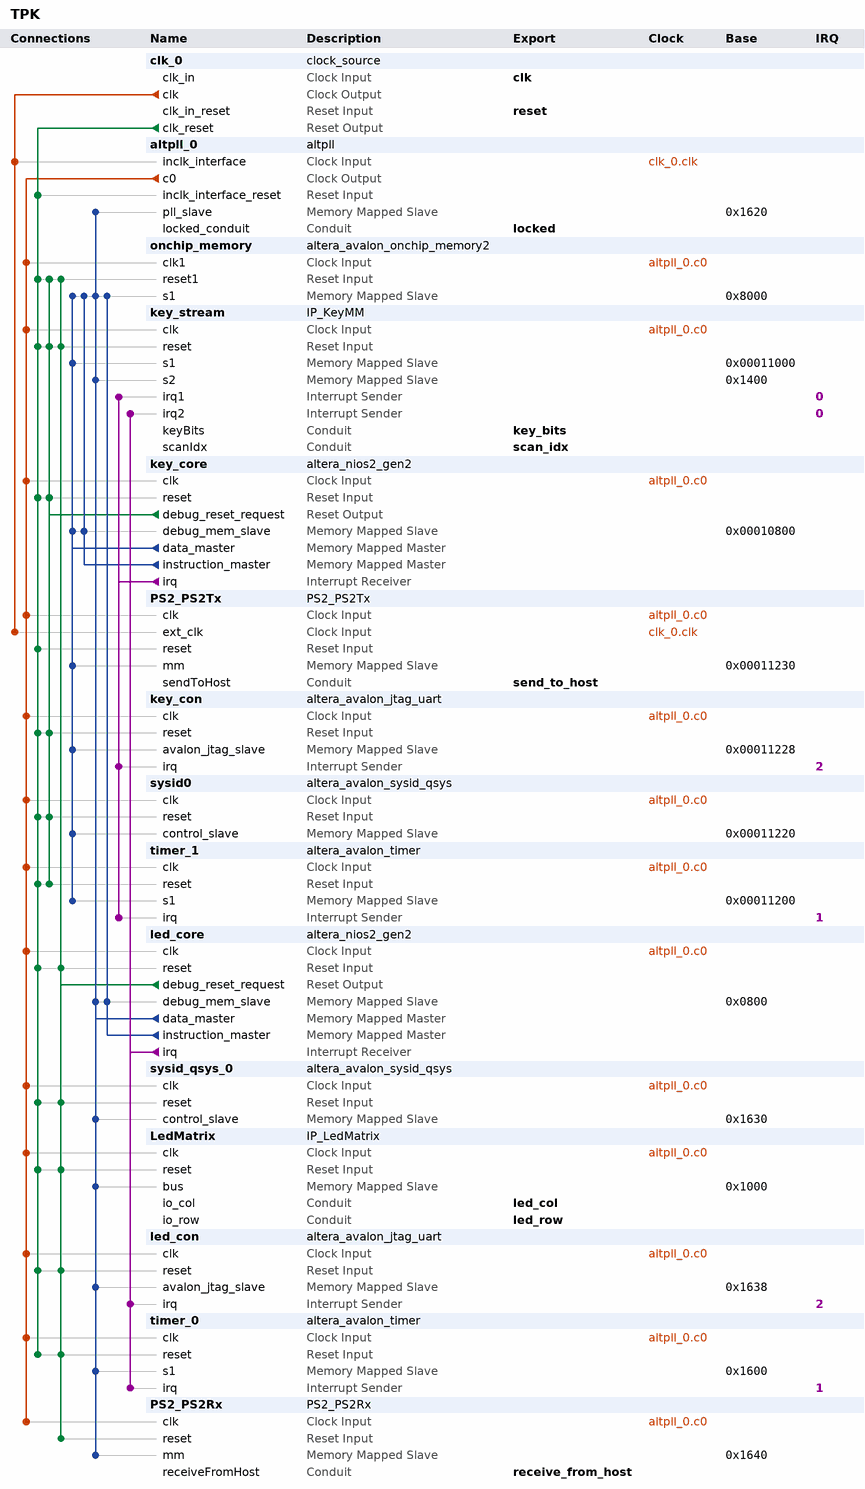
[diagram p0: system contents]
# Platform Designer (Qsys) system TPK, Cyclone IV E EP4CE10E22C8
# Parameters at their usual value, and those the tool derives, are not listed.
package require -exact qsys 21.1
create_system TPK
set_project_property DEVICE_FAMILY {Cyclone IV E}
set_project_property DEVICE EP4CE10E22C8

add_instance clk_0 clock_source 21.1
set_instance_parameter_value clk_0 clockFrequency 50000000

add_instance altpll_0 altpll 21.1
set_instance_parameter_value altpll_0 CLK0_DIVIDE_BY 2
set_instance_parameter_value altpll_0 CLK0_MULTIPLY_BY 3
set_instance_parameter_value altpll_0 INCLK0_INPUT_FREQUENCY 20000
set_instance_parameter_value altpll_0 PORT_ARESET PORT_UNUSED
set_instance_parameter_value altpll_0 PORT_LOCKED PORT_USED
set_instance_parameter_value altpll_0 PORT_clk1 PORT_UNUSED
set_instance_parameter_value altpll_0 PORT_clk2 PORT_UNUSED
set_instance_parameter_value altpll_0 PORT_clk3 PORT_UNUSED

add_instance onchip_memory altera_avalon_onchip_memory2 21.1
set_instance_parameter_value onchip_memory allowInSystemMemoryContentEditor true
set_instance_parameter_value onchip_memory dataWidth 32
set_instance_parameter_value onchip_memory dualPort false
set_instance_parameter_value onchip_memory initMemContent true
set_instance_parameter_value onchip_memory initializationFileName E:/DEVELOPMENT/PROJECTS/TPK/Qsys/Software/tpk_led/mem_init/Software.hex
set_instance_parameter_value onchip_memory instanceID qm
set_instance_parameter_value onchip_memory memorySize 32768
set_instance_parameter_value onchip_memory useNonDefaultInitFile true

add_instance key_stream IP_KeyMM 1.0

add_instance key_core altera_nios2_gen2 21.1
set_instance_parameter_value key_core dcache_size 2048
set_instance_parameter_value key_core exceptionSlave onchip_memory.s1
set_instance_parameter_value key_core icache_size 4096
set_instance_parameter_value key_core impl Tiny
set_instance_parameter_value key_core resetSlave onchip_memory.s1

add_instance PS2_PS2Tx PS2_PS2Tx 1.0

add_instance key_con altera_avalon_jtag_uart 21.1
set_instance_parameter_value key_con readBufferDepth 16
set_instance_parameter_value key_con simInteractiveOptions NO_INTERACTIVE_WINDOWS
set_instance_parameter_value key_con writeBufferDepth 16

add_instance sysid0 altera_avalon_sysid_qsys 21.1
set_instance_parameter_value sysid0 id 1

add_instance timer_1 altera_avalon_timer 21.1
set_instance_parameter_value timer_1 alwaysRun true
set_instance_parameter_value timer_1 fixedPeriod true
set_instance_parameter_value timer_1 period 1
set_instance_parameter_value timer_1 periodUnits MSEC
set_instance_parameter_value timer_1 snapshot false

add_instance led_core altera_nios2_gen2 21.1
set_instance_parameter_value led_core dcache_size 2048
set_instance_parameter_value led_core exceptionOffset 16416
set_instance_parameter_value led_core exceptionSlave onchip_memory.s1
set_instance_parameter_value led_core icache_size 4096
set_instance_parameter_value led_core impl Tiny
set_instance_parameter_value led_core resetOffset 16384
set_instance_parameter_value led_core resetSlave onchip_memory.s1

add_instance sysid_qsys_0 altera_avalon_sysid_qsys 21.1
set_instance_parameter_value sysid_qsys_0 id 493

add_instance LedMatrix IP_LedMatrix 1.0

add_instance led_con altera_avalon_jtag_uart 21.1
set_instance_parameter_value led_con readBufferDepth 16
set_instance_parameter_value led_con readIRQThreshold 1
set_instance_parameter_value led_con simInteractiveOptions NO_INTERACTIVE_WINDOWS
set_instance_parameter_value led_con writeBufferDepth 16
set_instance_parameter_value led_con writeIRQThreshold 1

add_instance timer_0 altera_avalon_timer 21.1
set_instance_parameter_value timer_0 alwaysRun true
set_instance_parameter_value timer_0 fixedPeriod true
set_instance_parameter_value timer_0 period 1
set_instance_parameter_value timer_0 periodUnits MSEC
set_instance_parameter_value timer_0 snapshot false

add_instance PS2_PS2Rx PS2_PS2Rx 1.0

# connections
add_connection altpll_0.c0 key_con.clk clock
add_connection altpll_0.c0 key_core.clk clock
add_connection altpll_0.c0 key_stream.clk clock
add_connection altpll_0.c0 led_con.clk clock
add_connection altpll_0.c0 led_core.clk clock
add_connection altpll_0.c0 LedMatrix.clk clock
add_connection altpll_0.c0 onchip_memory.clk1 clock
add_connection altpll_0.c0 PS2_PS2Rx.clk clock
add_connection altpll_0.c0 PS2_PS2Tx.clk clock
add_connection altpll_0.c0 sysid0.clk clock
add_connection altpll_0.c0 sysid_qsys_0.clk clock
add_connection altpll_0.c0 timer_0.clk clock
add_connection altpll_0.c0 timer_1.clk clock
add_connection clk_0.clk altpll_0.inclk_interface clock
add_connection clk_0.clk PS2_PS2Tx.ext_clk clock
add_connection clk_0.clk_reset altpll_0.inclk_interface_reset reset
add_connection clk_0.clk_reset key_con.reset reset
add_connection clk_0.clk_reset key_core.reset reset
add_connection clk_0.clk_reset key_stream.reset reset
add_connection clk_0.clk_reset led_con.reset reset
add_connection clk_0.clk_reset led_core.reset reset
add_connection clk_0.clk_reset LedMatrix.reset reset
add_connection clk_0.clk_reset onchip_memory.reset1 reset
add_connection clk_0.clk_reset PS2_PS2Tx.reset reset
add_connection clk_0.clk_reset sysid0.reset reset
add_connection clk_0.clk_reset sysid_qsys_0.reset reset
add_connection clk_0.clk_reset timer_0.reset reset
add_connection clk_0.clk_reset timer_1.reset reset
add_connection key_core.debug_reset_request key_con.reset reset
add_connection key_core.debug_reset_request key_core.reset reset
add_connection key_core.debug_reset_request key_stream.reset reset
add_connection key_core.debug_reset_request onchip_memory.reset1 reset
add_connection key_core.debug_reset_request sysid0.reset reset
add_connection key_core.debug_reset_request timer_1.reset reset
add_connection led_core.debug_reset_request key_stream.reset reset
add_connection led_core.debug_reset_request led_con.reset reset
add_connection led_core.debug_reset_request led_core.reset reset
add_connection led_core.debug_reset_request LedMatrix.reset reset
add_connection led_core.debug_reset_request onchip_memory.reset1 reset
add_connection led_core.debug_reset_request PS2_PS2Rx.reset reset
add_connection led_core.debug_reset_request sysid_qsys_0.reset reset
add_connection led_core.debug_reset_request timer_0.reset reset
add_connection key_core.data_master key_con.avalon_jtag_slave avalon
set_connection_parameter_value key_core.data_master/key_con.avalon_jtag_slave baseAddress 0x00011228
add_connection key_core.data_master key_core.debug_mem_slave avalon
set_connection_parameter_value key_core.data_master/key_core.debug_mem_slave baseAddress 0x00010800
add_connection key_core.data_master key_stream.s1 avalon
set_connection_parameter_value key_core.data_master/key_stream.s1 baseAddress 0x00011000
add_connection key_core.data_master onchip_memory.s1 avalon
set_connection_parameter_value key_core.data_master/onchip_memory.s1 baseAddress 0x8000
add_connection key_core.data_master PS2_PS2Tx.mm avalon
set_connection_parameter_value key_core.data_master/PS2_PS2Tx.mm baseAddress 0x00011230
add_connection key_core.data_master sysid0.control_slave avalon
set_connection_parameter_value key_core.data_master/sysid0.control_slave baseAddress 0x00011220
add_connection key_core.data_master timer_1.s1 avalon
set_connection_parameter_value key_core.data_master/timer_1.s1 baseAddress 0x00011200
add_connection key_core.instruction_master key_core.debug_mem_slave avalon
set_connection_parameter_value key_core.instruction_master/key_core.debug_mem_slave baseAddress 0x00010800
add_connection key_core.instruction_master onchip_memory.s1 avalon
set_connection_parameter_value key_core.instruction_master/onchip_memory.s1 baseAddress 0x8000
add_connection led_core.data_master altpll_0.pll_slave avalon
set_connection_parameter_value led_core.data_master/altpll_0.pll_slave baseAddress 0x1620
add_connection led_core.data_master key_stream.s2 avalon
set_connection_parameter_value led_core.data_master/key_stream.s2 baseAddress 0x1400
add_connection led_core.data_master led_con.avalon_jtag_slave avalon
set_connection_parameter_value led_core.data_master/led_con.avalon_jtag_slave baseAddress 0x1638
add_connection led_core.data_master led_core.debug_mem_slave avalon
set_connection_parameter_value led_core.data_master/led_core.debug_mem_slave baseAddress 0x0800
add_connection led_core.data_master LedMatrix.bus avalon
set_connection_parameter_value led_core.data_master/LedMatrix.bus baseAddress 0x1000
add_connection led_core.data_master onchip_memory.s1 avalon
set_connection_parameter_value led_core.data_master/onchip_memory.s1 baseAddress 0x8000
add_connection led_core.data_master PS2_PS2Rx.mm avalon
set_connection_parameter_value led_core.data_master/PS2_PS2Rx.mm baseAddress 0x1640
add_connection led_core.data_master sysid_qsys_0.control_slave avalon
set_connection_parameter_value led_core.data_master/sysid_qsys_0.control_slave baseAddress 0x1630
add_connection led_core.data_master timer_0.s1 avalon
set_connection_parameter_value led_core.data_master/timer_0.s1 baseAddress 0x1600
add_connection led_core.instruction_master led_core.debug_mem_slave avalon
set_connection_parameter_value led_core.instruction_master/led_core.debug_mem_slave baseAddress 0x0800
add_connection led_core.instruction_master onchip_memory.s1 avalon
set_connection_parameter_value led_core.instruction_master/onchip_memory.s1 baseAddress 0x8000
add_connection key_core.irq key_con.irq interrupt
set_connection_parameter_value key_core.irq/key_con.irq irqNumber 2
add_connection key_core.irq key_stream.irq1 interrupt
set_connection_parameter_value key_core.irq/key_stream.irq1 irqNumber 0
add_connection key_core.irq timer_1.irq interrupt
set_connection_parameter_value key_core.irq/timer_1.irq irqNumber 1
add_connection led_core.irq key_stream.irq2 interrupt
set_connection_parameter_value led_core.irq/key_stream.irq2 irqNumber 0
add_connection led_core.irq led_con.irq interrupt
set_connection_parameter_value led_core.irq/led_con.irq irqNumber 2
add_connection led_core.irq timer_0.irq interrupt
set_connection_parameter_value led_core.irq/timer_0.irq irqNumber 1

# exported interfaces
add_interface clk clock sink
set_interface_property clk EXPORT_OF clk_0.clk_in
add_interface key_bits conduit end
set_interface_property key_bits EXPORT_OF key_stream.keyBits
add_interface led_col conduit end
set_interface_property led_col EXPORT_OF LedMatrix.io_col
add_interface led_row conduit end
set_interface_property led_row EXPORT_OF LedMatrix.io_row
add_interface locked conduit end
set_interface_property locked EXPORT_OF altpll_0.locked_conduit
add_interface receive_from_host conduit end
set_interface_property receive_from_host EXPORT_OF PS2_PS2Rx.receiveFromHost
add_interface reset reset sink
set_interface_property reset EXPORT_OF clk_0.clk_in_reset
add_interface scan_idx conduit end
set_interface_property scan_idx EXPORT_OF key_stream.scanIdx
add_interface send_to_host conduit end
set_interface_property send_to_host EXPORT_OF PS2_PS2Tx.sendToHost

set_interconnect_requirement {$system} qsys_mm.clockCrossingAdapter HANDSHAKE
set_interconnect_requirement {$system} qsys_mm.enableEccProtection FALSE
set_interconnect_requirement {$system} qsys_mm.insertDefaultSlave FALSE
set_interconnect_requirement {$system} qsys_mm.maxAdditionalLatency 1

save_system TPK.qsys
